# EAGLE design Galaksija keyboard matrix (EAGLE 9.6.2)
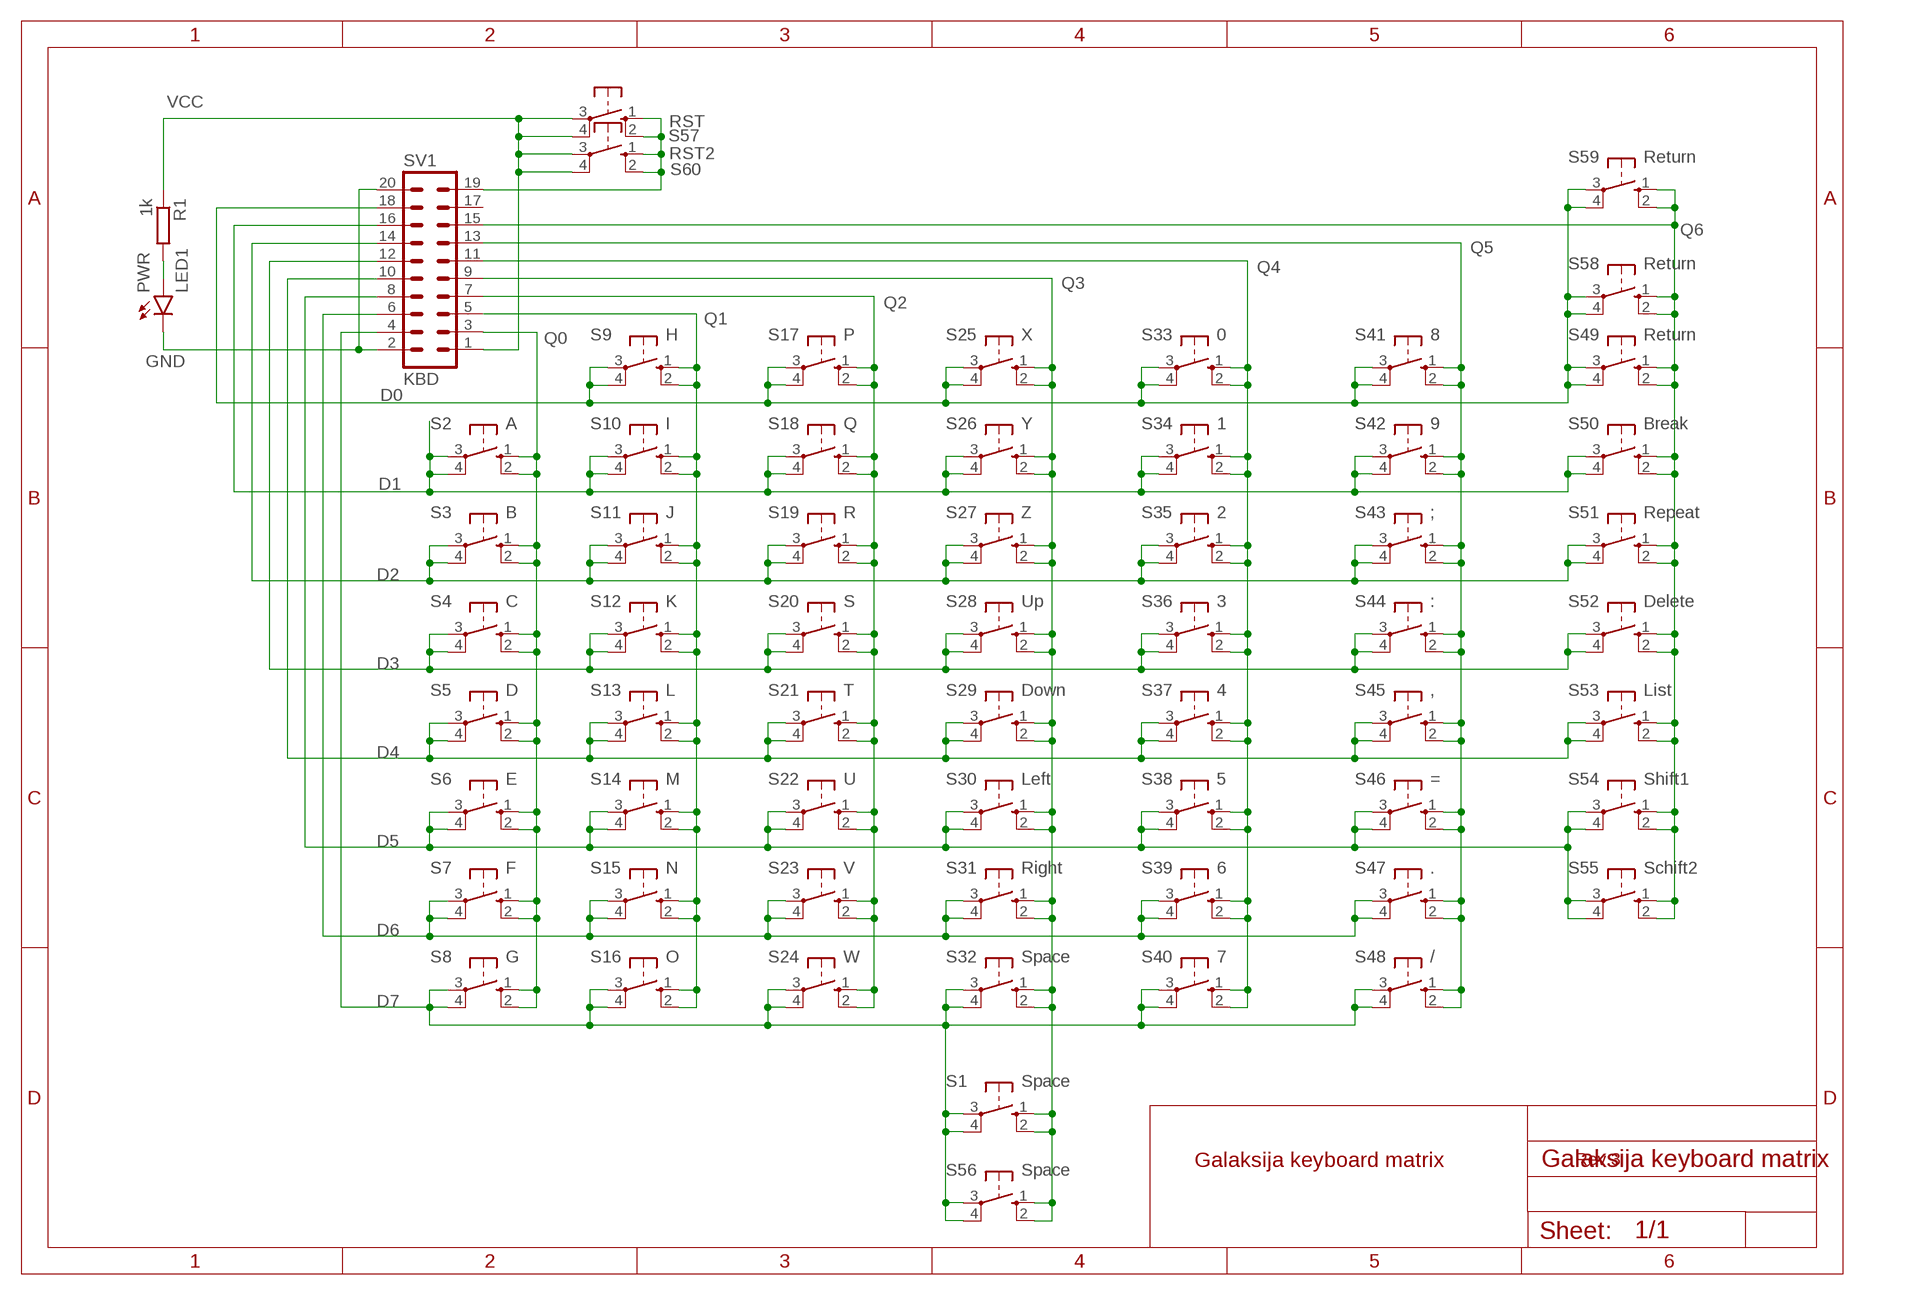
[diagram p0: schematic, sheet 1]

## Parts
LED1  PWR  LED5MM  [LED5MM]
R1  1k  R-EU_0207/10  [0207/10]
S1  Space  40-XX  [B3F-40XX]
S2  A  40-XX  [B3F-40XX]
S3  B  40-XX  [B3F-40XX]
S4  C  40-XX  [B3F-40XX]
S5  D  40-XX  [B3F-40XX]
S6  E  40-XX  [B3F-40XX]
S7  F  40-XX  [B3F-40XX]
S8  G  40-XX  [B3F-40XX]
S9  H  40-XX  [B3F-40XX]
S10  I  40-XX  [B3F-40XX]
S11  J  40-XX  [B3F-40XX]
S12  K  40-XX  [B3F-40XX]
S13  L  40-XX  [B3F-40XX]
S14  M  40-XX  [B3F-40XX]
S15  N  40-XX  [B3F-40XX]
S16  O  40-XX  [B3F-40XX]
S17  P  40-XX  [B3F-40XX]
S18  Q  40-XX  [B3F-40XX]
S19  R  40-XX  [B3F-40XX]
S20  S  40-XX  [B3F-40XX]
S21  T  40-XX  [B3F-40XX]
S22  U  40-XX  [B3F-40XX]
S23  V  40-XX  [B3F-40XX]
S24  W  40-XX  [B3F-40XX]
S25  X  40-XX  [B3F-40XX]
S26  Y  40-XX  [B3F-40XX]
S27  Z  40-XX  [B3F-40XX]
S28  Up  40-XX  [B3F-40XX]
S29  Down  40-XX  [B3F-40XX]
S30  Left  40-XX  [B3F-40XX]
S31  Right  40-XX  [B3F-40XX]
S32  Space  40-XX  [B3F-40XX]
S33  0  40-XX  [B3F-40XX]
S34  1  40-XX  [B3F-40XX]
S35  2  40-XX  [B3F-40XX]
S36  3  40-XX  [B3F-40XX]
S37  4  40-XX  [B3F-40XX]
S38  5  40-XX  [B3F-40XX]
S39  6  40-XX  [B3F-40XX]
S40  7  40-XX  [B3F-40XX]
S41  8  40-XX  [B3F-40XX]
S42  9  40-XX  [B3F-40XX]
S43  ;  40-XX  [B3F-40XX]
S44  :  40-XX  [B3F-40XX]
S45  ,  40-XX  [B3F-40XX]
S46  =  40-XX  [B3F-40XX]
S47  .  40-XX  [B3F-40XX]
S48  /  40-XX  [B3F-40XX]
S49  Return  40-XX  [B3F-40XX]
S50  Break  40-XX  [B3F-40XX]
S51  Repeat  40-XX  [B3F-40XX]
S52  Delete  40-XX  [B3F-40XX]
S53  List  40-XX  [B3F-40XX]
S54  Shift1  40-XX  [B3F-40XX]
S55  Schift2  40-XX  [B3F-40XX]
S56  Space  40-XX  [B3F-40XX]
S57  RST  40-XX  [B3F-40XX]
S58  Return  40-XX  [B3F-40XX]
S59  Return  40-XX  [B3F-40XX]
S60  RST2  10-XX  [B3F-10XX]
SV1  KBD  ML20  [ML20]

## Nets
D0: S9.3(P) S9.4(P1) S17.3(P) S17.4(P1) S25.3(P) S25.4(P1) S33.3(P) S33.4(P1) S41.3(P) S41.4(P1) S49.3(P) S49.4(P1) S58.3(P) S58.4(P1) S59.3(P) S59.4(P1) SV1.18
D1: S2.3(P) S2.4(P1) S10.3(P) S10.4(P1) S18.3(P) S18.4(P1) S26.3(P) S26.4(P1) S34.3(P) S34.4(P1) S42.3(P) S42.4(P1) S50.3(P) S50.4(P1) SV1.16
D2: S3.3(P) S3.4(P1) S11.3(P) S11.4(P1) S19.3(P) S19.4(P1) S27.3(P) S27.4(P1) S35.3(P) S35.4(P1) S43.3(P) S43.4(P1) S51.3(P) S51.4(P1) SV1.14
D3: S4.3(P) S4.4(P1) S12.3(P) S12.4(P1) S20.3(P) S20.4(P1) S28.3(P) S28.4(P1) S36.3(P) S36.4(P1) S44.3(P) S44.4(P1) S52.3(P) S52.4(P1) SV1.12
D4: S5.3(P) S5.4(P1) S13.3(P) S13.4(P1) S21.3(P) S21.4(P1) S29.3(P) S29.4(P1) S37.3(P) S37.4(P1) S45.3(P) S45.4(P1) S53.3(P) S53.4(P1) SV1.10
D5: S6.3(P) S6.4(P1) S14.3(P) S14.4(P1) S22.3(P) S22.4(P1) S30.3(P) S30.4(P1) S38.3(P) S38.4(P1) S46.3(P) S46.4(P1) S54.3(P) S54.4(P1) S55.3(P) S55.4(P1) SV1.8
D6: S7.3(P) S7.4(P1) S15.3(P) S15.4(P1) S23.3(P) S23.4(P1) S31.3(P) S31.4(P1) S39.3(P) S39.4(P1) S47.3(P) S47.4(P1) SV1.6
D7: S1.3(P) S1.4(P1) S8.3(P) S8.4(P1) S16.3(P) S16.4(P1) S24.3(P) S24.4(P1) S32.3(P) S32.4(P1) S40.3(P) S40.4(P1) S48.3(P) S48.4(P1) S56.3(P) S56.4(P1) SV1.4
GND: LED1.K(C) SV1.2 SV1.20
N$1: LED1.A R1.2
Q0: S2.1(S) S2.2(S1) S3.1(S) S3.2(S1) S4.1(S) S4.2(S1) S5.1(S) S5.2(S1) S6.1(S) S6.2(S1) S7.1(S) S7.2(S1) S8.1(S) S8.2(S1) SV1.3
Q1: S9.1(S) S9.2(S1) S10.1(S) S10.2(S1) S11.1(S) S11.2(S1) S12.1(S) S12.2(S1) S13.1(S) S13.2(S1) S14.1(S) S14.2(S1) S15.1(S) S15.2(S1) S16.1(S) S16.2(S1) SV1.5
Q2: S17.1(S) S17.2(S1) S18.1(S) S18.2(S1) S19.1(S) S19.2(S1) S20.1(S) S20.2(S1) S21.1(S) S21.2(S1) S22.1(S) S22.2(S1) S23.1(S) S23.2(S1) S24.1(S) S24.2(S1) SV1.7
Q3: S1.1(S) S1.2(S1) S25.1(S) S25.2(S1) S26.1(S) S26.2(S1) S27.1(S) S27.2(S1) S28.1(S) S28.2(S1) S29.1(S) S29.2(S1) S30.1(S) S30.2(S1) S31.1(S) S31.2(S1) S32.1(S) S32.2(S1) S56.1(S) S56.2(S1) SV1.9
Q4: S33.1(S) S33.2(S1) S34.1(S) S34.2(S1) S35.1(S) S35.2(S1) S36.1(S) S36.2(S1) S37.1(S) S37.2(S1) S38.1(S) S38.2(S1) S39.1(S) S39.2(S1) S40.1(S) S40.2(S1) SV1.11
Q5: S41.1(S) S41.2(S1) S42.1(S) S42.2(S1) S43.1(S) S43.2(S1) S44.1(S) S44.2(S1) S45.1(S) S45.2(S1) S46.1(S) S46.2(S1) S47.1(S) S47.2(S1) S48.1(S) S48.2(S1) SV1.13
Q6: S49.1(S) S49.2(S1) S50.1(S) S50.2(S1) S51.1(S) S51.2(S1) S52.1(S) S52.2(S1) S53.1(S) S53.2(S1) S54.1(S) S54.2(S1) S55.1(S) S55.2(S1) S58.1(S) S58.2(S1) S59.1(S) S59.2(S1) SV1.15
RST: S57.1(S) S57.2(S1) S60.1(S) S60.2(S1) SV1.19
VCC: R1.1 S57.3(P) S57.4(P1) S60.3(P) S60.4(P1) SV1.1
Unconnected: SV1.17

## Notes on the sheet
- Galaksija keyboard matrix | Rev.3

## Library data of the parts
LED1 = led:LED: LED OSRAM: - CHIPLED LG R971, LG N971, LY N971, LG Q971, LY Q971, LO R971, LY R971 LH N974, LH R974 LS Q976, LO Q976, LY Q976 LO Q996 - Hyper CHIPLED LW Q18S LB Q993, LB Q99A, LB R99A - SideLED LS A670, LO A670, LY A670, LG A670, LP A670 LB A673, LV A673, LT A673, LW A673 LH A674 LY A675 LS A676, LA A676, LO A676, LY A676, LW A676 LS A679, LY A679, LG A679 - Hyper Micro SIDELED® LS Y876, LA Y876, LO Y876, LY Y876 LT Y87S - SmartLED LW L88C, LW L88S LB L89C, LB L89S, LG L890 LS L89K, LO L89K, LY L89K LS L896, LA L896, LO L896, LY L896 - TOPLED LS T670, LO T670, LY T670, LG T670, LP T670 LSG T670, LSP T670, LSY T670, LOP T670, LYG T670 LG T671, LOG T671, LSG T671 LB T673, LV T673, LT T673, LW T673 LH T674 LS T676, LA T676, LO T676, LY T676, LB T676, LH T676, LSB T676, LW T676 LB T67C, LV T67C, LT T67C, LS T67K, LO T67K, LY T67K, LW E67C LS E67B, LA E67B, LO E67B, LY E67B, LB E67C, LV E67C, LT E67C LW T67C LS T679, LY T679, LG T679 LS T770, LO T770, LY T770, LG T770, LP T770 LB T773, LV T773, LT T773, LW T773 LH T774 LS E675, LA E675, LY E675, LS T675 LS T776, LA T776, LO T776, LY T776, LB T776 LHGB T686 LT T68C, LB T68C - Hyper Mini TOPLED® LB M676 - Mini TOPLED Santana® LG M470 LS M47K, LO M47K, LY M47K Source: http://www.osram.convergy.de LUXEON: - LUMILED® LXK2-PW12-R00, LXK2-PW12-S00, LXK2-PW14-U00, LXK2-PW14-V00 LXK2-PM12-R00, LXK2-PM12-S00, LXK2-PM14-U00 LXK2-PE12-Q00, LXK2-PE12-R00, LXK2-PE12-S00, LXK2-PE14-T00, LXK2-PE14-U00 LXK2-PB12-K00, LXK2-PB12-L00, LXK2-PB12-M00, LXK2-PB14-N00, LXK2-PB14-P00, LXK2-PB14-Q00 LXK2-PR12-L00, LXK2-PR12-M00, LXK2-PR14-Q00, LXK2-PR14-R00 LXK2-PD12-Q00, LXK2-PD12-R00, LXK2-PD12-S00 LXK2-PH12-R00, LXK2-PH12-S00 LXK2-PL12-P00, LXK2-PL12-Q00, LXK2-PL12-R00 Source: www.luxeon.com KINGBRIGHT: KA-3528ASYC Source: www.kingbright.com
R1 = rcl:R-EU_: RESISTOR, European symbol; SPICEPREFIX: R
S1-S59 = switch-omron:40-XX: OMRON SWITCH; MF: OMRON COMPONENTS USA; MPN: B3F-4000; OC_FARNELL: 176434; OC_NEWARK: 36K3105
S60 = switch-omron:10-XX: OMRON SWITCH; MPN: B3F-1000; OC_FARNELL: 176432; OC_NEWARK: 36M3542
SV1 = con-harting-ml:ML20: HARTING; OC_FARNELL: unknown; OC_NEWARK: unknown

## Board
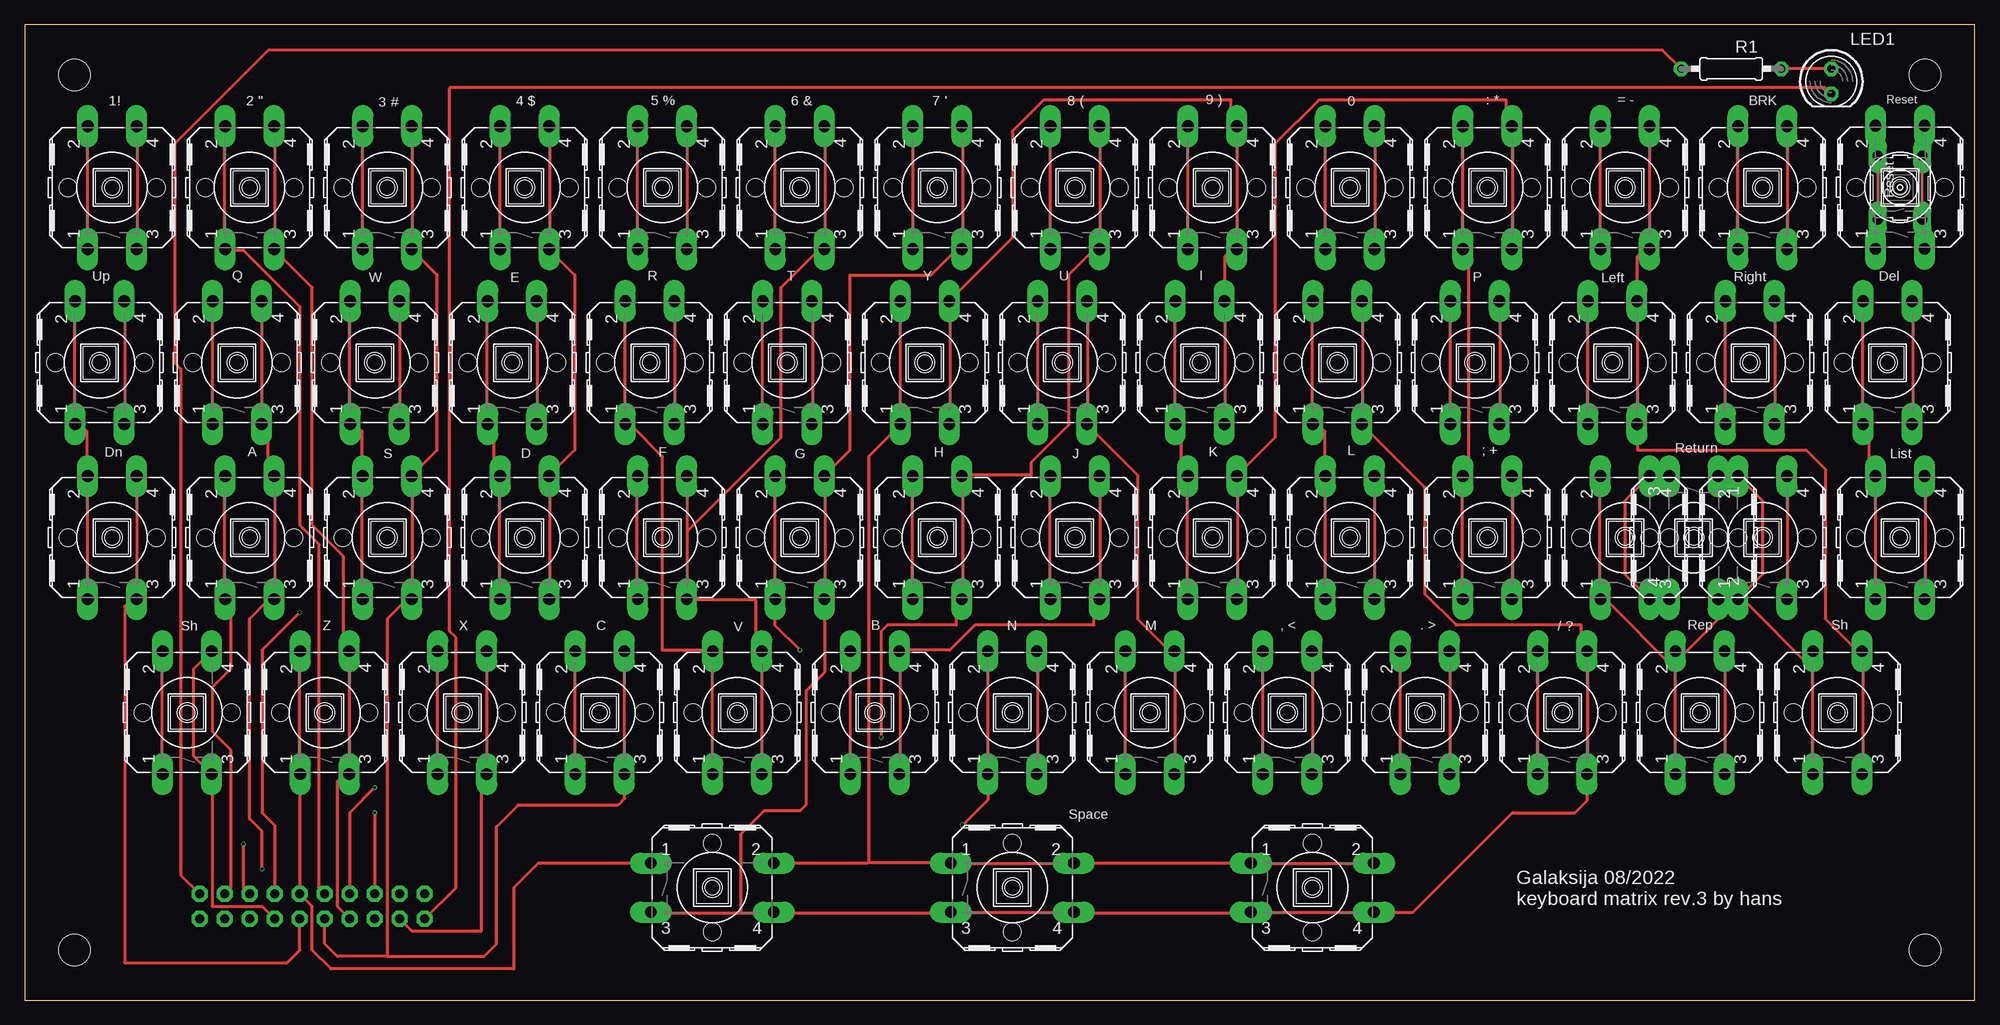
[diagram p1: board, top side]
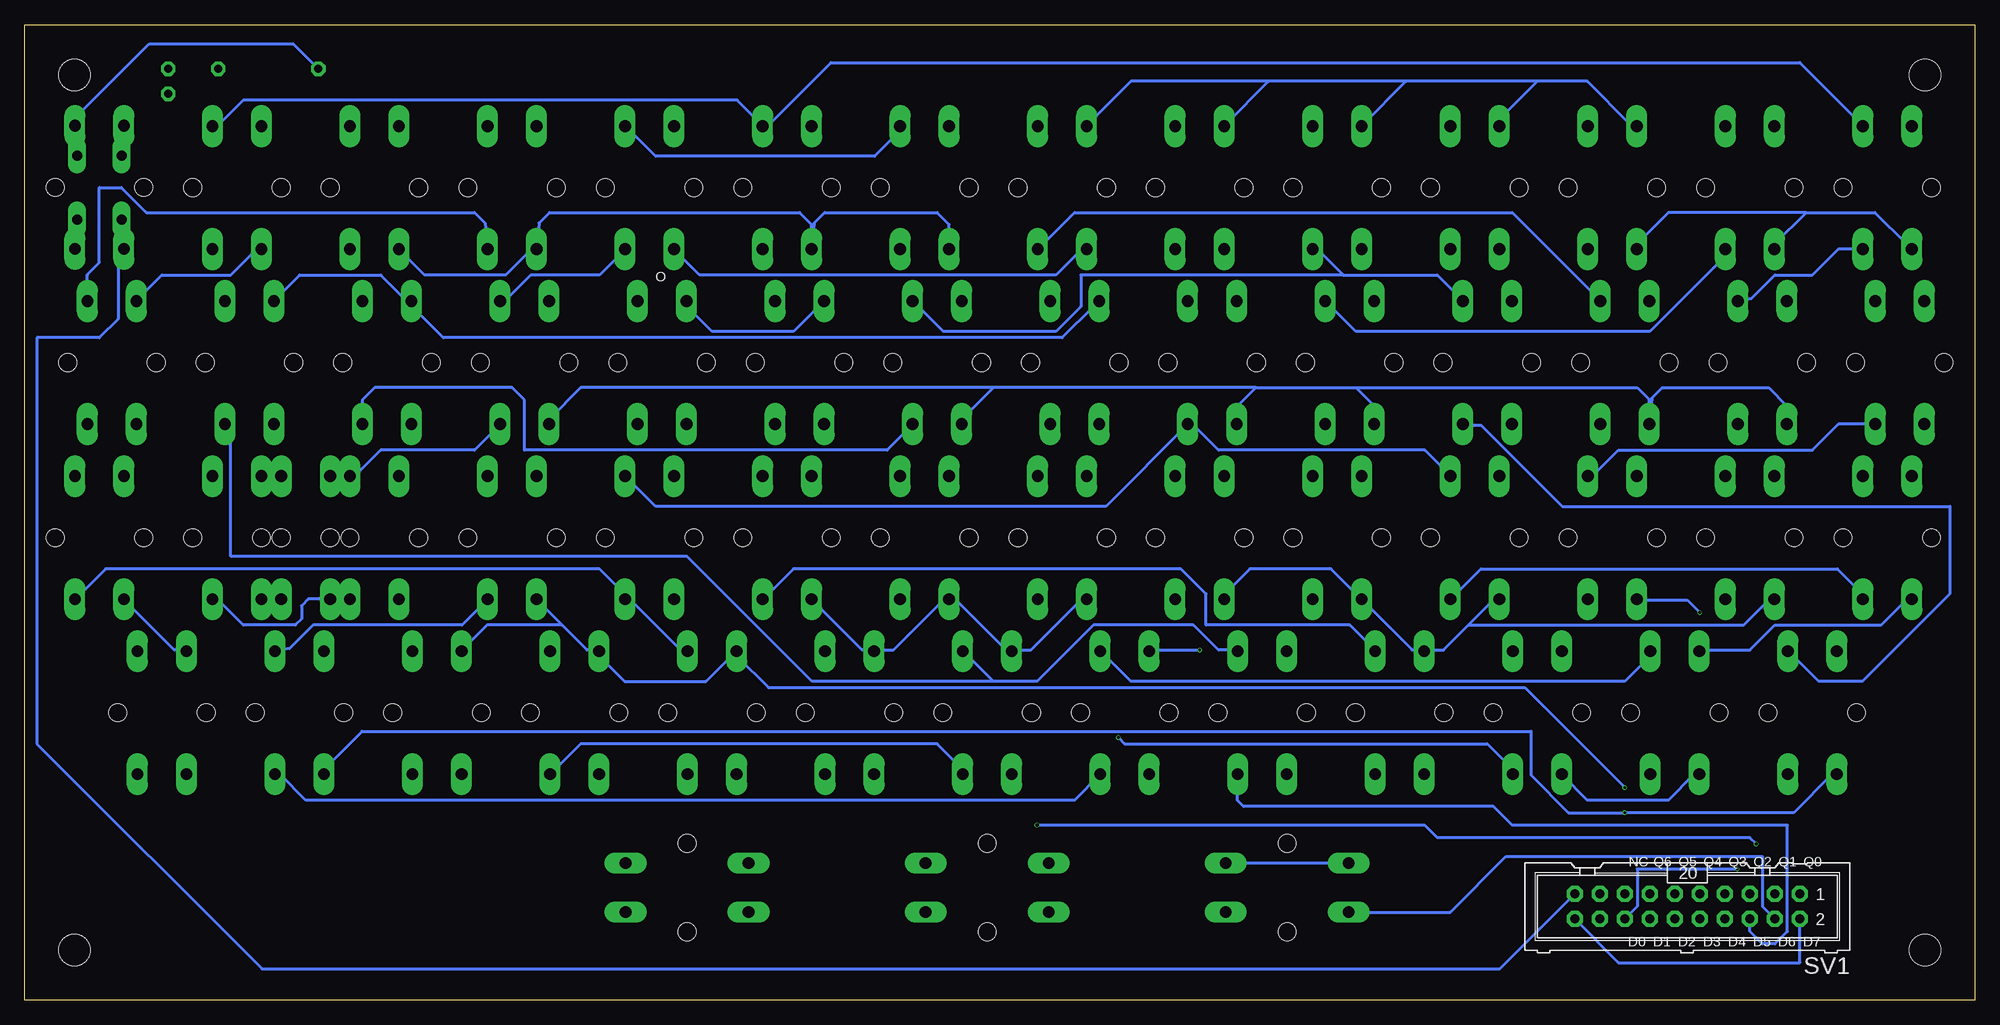
[diagram p2: board, bottom side, seen from below]

Size 198.1 x 99.11 mm. Coordinates in mm from the lower left corner, seen from the top.
Outline: 0,0 198.1,0 198.1,99.11 0,99.11 0,0
Copper layers (1*16): Top 0.035mm / dielectric 1.6mm / Bottom 0.035mm
Design rules "jlcpcb-2layers *": minimum track width 12mil, minimum drill 0.3mm, track to track 8mil, track to pad 8mil, pad to pad 8mil, via to via 8mil, smd to smd 5mil, copper to edge 0.2mm, drill to drill 8mil, minimum pad ring 10mil, minimum via ring 3mil, stop-mask expansion 4mil, vias tented up to drill 0mil, thermal gap 10mil
Holes 3.2 mm at 193.04,93.98 5.08,93.98 5.08,5.08 193.04,5.08

### Footprints (pad centres in the part's own frame; a part is rotated, then mirrored left to right if it is on the bottom)
LED5MM = drill 0.813 octagon: A -1.27,0; K 1.27,0
0207/10 = drill 0.813 octagon: 1 -5.08,0; 2 5.08,0
B3F-40XX = drill 1.194 long: 1 -6.248,2.489; 2 6.248,2.489; 3 -6.248,-2.489; 4 6.248,-2.489 | hole 1.803: 0,-4.496; 0,4.496
B3F-10XX = drill 1.016 long: 1 -3.251,2.261; 2 3.251,2.261; 3 -3.251,-2.261; 4 3.251,-2.261
ML20 = drill 0.914 octagon: 1 -11.43,-1.27; 2 -11.43,1.27; 3 -8.89,-1.27; 4 -8.89,1.27; 5 -6.35,-1.27; 6 -6.35,1.27; 7 -3.81,-1.27; 8 -3.81,1.27; 9 -1.27,-1.27; 10 -1.27,1.27; 11 1.27,-1.27; 12 1.27,1.27; 13 3.81,-1.27; 14 3.81,1.27; 15 6.35,-1.27; 16 6.35,1.27; 17 8.89,-1.27; 18 8.89,1.27; 19 11.43,-1.27; 20 11.43,1.27

### Placement (x,y rotation side)
LED1  183.51,93.34 270 top
R1  173.35,94.61 0 top
S1  69.85,11.43 0 top
S2  22.86,46.99 90 top
S3  86.36,29.21 90 top
S4  58.42,29.21 90 top
S5  50.8,46.99 90 top
S6  49.53,64.77 90 top
S7  64.77,46.99 90 top
S8  78.74,46.99 90 top
S9  92.71,46.99 90 top
S10  119.38,64.77 90 top
S11  106.68,46.99 90 top
S12  120.65,46.99 90 top
S13  134.62,46.99 90 top
S14  114.3,29.21 90 top
S15  100.33,29.21 90 top
S16  133.35,64.77 90 top
S17  147.32,64.77 90 top
S18  21.59,64.77 90 top
S19  63.5,64.77 90 top
S20  36.83,46.99 90 top
S21  77.47,64.77 90 top
S22  105.41,64.77 90 top
S23  72.39,29.21 90 top
S24  35.56,64.77 90 top
S25  44.45,29.21 90 top
S26  91.44,64.77 90 top
S27  30.48,29.21 90 top
S28  7.62,64.77 90 top
S29  8.89,46.99 90 top
S30  161.29,64.77 90 top
S31  175.26,64.77 90 top
S32  100.33,11.43 0 top
S33  134.62,82.55 90 top
S34  8.89,82.55 90 top
S35  22.86,82.55 90 top
S36  36.83,82.55 90 top
S37  50.8,82.55 90 top
S38  64.77,82.55 90 top
S39  78.74,82.55 90 top
S40  92.71,82.55 90 top
S41  106.68,82.55 90 top
S42  120.65,82.55 90 top
S43  148.59,46.99 90 top
S44  148.59,82.55 90 top
S45  128.27,29.21 90 top
S46  162.56,82.55 90 top
S47  142.24,29.21 90 top
S48  156.21,29.21 90 top
S49  162.56,46.99 90 top
S50  176.53,82.55 90 top
S51  170.18,29.21 90 top
S52  189.23,64.77 90 top
S53  190.5,46.99 90 top
S54  16.51,29.21 90 top
S55  184.15,29.21 90 top
S56  130.81,11.43 0 top
S57  190.5,82.58 90 top
S58  176.53,46.99 90 top
S59  169.54,46.99 270 top
S60  190.5,82.55 90 top
SV1  29.21,9.53 180 bottom

### Tracks (layer width: path | path; a pad name or v marks a point on that pad's centre or on a via)
D0  (via drill 0.3)
  Top 0.305: S58.3 179.07,41.27 179.07,52.7 S58.4 | S49.3 162.56,43.23 162.56,50.75 S49.4 | S17.3 149.86,59.05 149.86,70.48 S17.4 | S33.3 137.16,76.83 137.16,88.27 S33.4 | SV1.18 39.37,6.99 46.35,6.99 46.35,22.86 S25.3 46.99,23.5 46.99,34.92 S25.4 | S41.4 109.22,88.27 109.22,76.83 S41.3 108.59,76.2 106.05,73.66 106.05,58.42 102.23,54.61 102.23,53.34 95.25,53.34 S9.4 95.25,52.7 95.25,41.27 S9.3 94.62,40.64 94.62,38.1 87.63,38.1 87,37.47 v87,26.67
  Bottom 0.305: S17.4 149.22,71.12 146.69,73.66 139.7,73.66 137.16,76.2 S33.3 | S17.3 149.86,58.42 152.4,55.88 161.92,55.88 164.47,53.34 S49.4 S59.3 | S58.3 178.44,40.64 175.89,38.1 170.59,38.1 169.96,38.73 169.96,40.07 169.28,40.74 S59.4 S49.3 | v87,26.67 86.36,26.04 49.53,26.04 46.99,23.5 S25.3 | S33.4 136.52,88.27 133.98,85.72 111.76,85.72 109.22,88.27 S41.4
D1  (via drill 0.3)
  Top 0.305: S34.3 11.43,76.83 11.43,88.27 S34.4 | S18.4 24.13,70.48 24.13,59.05 S18.3 24.13,58.42 24.77,57.78 24.77,53.34 S2.4 25.4,52.7 25.4,41.27 S2.3 24.77,40.64 22.86,38.73 22.86,18.41 24.13,17.14 v24.13,13.34 | S50.3 179.07,76.83 179.07,88.27 S50.4 | S26.3 93.98,59.05 93.98,70.48 S26.4 93.98,71.12 100.33,77.47 100.33,88.27 103.51,91.44 122.56,91.44 122.56,88.9 S42.4 123.19,88.27 123.19,76.83 S42.3 122.56,76.2 121.92,75.56 121.92,71.12 S10.4 121.92,70.48 121.92,59.05 S10.3
  Bottom 0.305: SV1.16 34.29,9.53 34.29,13.34 v24.13,13.34 | S34.3 13.87,76.3 16.51,73.66 20.32,73.66 22.73,71.25 S18.4 | S50.4 178.44,88.9 175.89,91.44 125.73,91.44 123.19,88.9 S42.4 122.56,88.9 116.2,95.25 17.78,95.25 11.43,88.9 S34.4
D2
  Top 0.305: S51.3 172.72,23.5 172.72,34.92 S51.4 | S43.3 151.13,41.27 151.13,52.7 S43.4 | S3.3 88.9,23.5 88.9,34.92 S3.4 88.9,35.56 93.98,35.56 96.52,38.1 108.59,38.1 108.59,40.64 S11.3 109.22,41.27 109.22,52.7 S11.4 | S19.3 66.04,59.05 66.04,70.48 S19.4 | S35.4 25.4,88.27 25.4,76.83 S35.3 25.4,76.2 29.21,72.39 29.21,48.26 32.38,45.09 32.38,35.56 S27.4 33.02,34.92 33.02,23.5 S27.3 32.38,22.86 31.75,22.23 31.75,9.53 SV1.14
  Bottom 0.305: S51.4 171.2,35.71 168.81,38.1 153.67,38.1 151.13,40.64 S43.3 | S19.4 65.41,70.48 62.87,67.94 33.02,67.94 24.77,76.2 S35.3 | S3.4 88.27,34.92 85.73,32.38 35.56,32.38 33.02,34.92 S27.4 | S51.3 172.08,22.86 169.54,20.32 91.44,20.32 88.9,22.86 S3.3
D3
  Top 0.305: S52.3 191.77,59.05 191.77,70.48 S52.4 | S12.3 123.19,41.27 123.19,52.7 S12.4 123.19,53.34 127,57.15 127,87 131.44,91.44 150.49,91.44 150.49,88.9 S44.4 151.13,88.27 151.13,76.83 S44.3 | SV1.12 30.48,5.71 31.75,4.45 36.83,4.45 | S36.4 39.37,88.27 39.37,76.83 S36.3 39.37,76.2 41.91,73.66 41.91,55.88 39.37,53.34 S20.4 39.37,52.7 39.37,41.27 S20.3 38.73,40.64 36.83,38.73 36.83,4.45 | S28.3 10.16,59.05 10.16,70.48 S28.4 | 36.83,4.45 46.67,4.45 47.94,5.71 47.94,17.62 50.16,19.84 60.32,19.84 60.96,20.48 60.91,20.53 S4.3 S4.4
  Bottom 0.305: S44.3 151.33,78.94 152.4,80.01 185.74,80.01 188.28,82.55 190.5,82.55 190.5,74.93 191.77,73.66 191.72,73.61 S52.4 | S28.3 13.87,58.52 16.51,55.88 36.2,55.88 38.73,53.34 S20.4 | S12.3 122.56,41.27 120.02,43.81 80.65,43.81 78.11,41.27 78.11,38.1 63.5,38.1 60.96,35.56 S4.4
D4
  Top 0.305: S53.3 193.04,41.27 193.04,52.7 S53.4 | S45.3 130.81,23.5 130.81,34.92 S45.4 | S13.4 137.16,52.7 137.16,41.27 S13.3 | SV1.10 27.94,5.08 26.67,3.81 10.16,3.81 10.16,40.01 10.79,40.64 S29.3 11.43,41.27 11.43,52.7 S29.4 | S21.3 80.01,59.05 80.01,70.48 S21.4 | S5.3 53.34,41.27 53.34,52.7 S5.4 53.34,53.34 55.88,55.88 55.88,73.66 53.34,76.2 S37.3 53.34,76.83 53.34,88.27 S37.4
  Bottom 0.305: S45.4 130.81,35.56 131.44,35.56 136.52,40.64 S13.3 137.16,41.27 139.7,43.81 189.86,43.81 192.41,41.27 S53.3 | S5.4 53.34,53.34 55.88,55.88 76.84,55.88 79.38,58.42 S21.3 80.01,58.42 88.27,50.16 133.98,50.16 136.52,52.7 S13.4 | S29.3 11.43,41.27 13.97,43.81 50.16,43.81 52.7,41.27 S5.3
D5
  Top 0.305: S55.3 186.69,23.5 186.69,34.92 S55.4 186.05,35.56 182.88,38.73 182.88,53.98 180.97,55.88 163.83,55.88 163.83,58.42 S30.3 163.83,59.05 163.83,70.48 S30.4 163.83,71.12 163.83,75.56 164.47,76.2 S46.3 165.1,76.83 165.1,88.27 S46.4 | S14.3 116.84,23.5 116.84,34.92 S14.4 116.2,35.56 113.03,38.73 113.03,53.34 107.95,58.42 S22.3 107.95,59.05 107.95,70.48 S22.4 | SV1.8 24.13,9.53 19.05,9.53 19.05,22.86 S54.3 17.14,24.82 17.14,33.6 S54.4 | S6.3 52.07,59.05 52.07,70.48 S6.4 | S38.3 67.31,76.83 67.31,88.27 S38.4
  Bottom 0.305: 64.14,73.66 54.61,73.66 52.07,71.12 S6.4 | 64.14,73.66 66.67,76.2 S38.3 | S54.4 18.41,34.92 15.88,32.38 11.43,32.38 2.54,41.27 2.54,50.16 41.91,50.16 50.16,58.42 51.43,58.42 S6.3 | 64.14,73.66 90.81,73.66 90.81,70.48 93.34,67.94 104.78,67.94 107.31,70.48 S22.4 | S30.3 163.78,61.01 162.56,62.23 148.59,62.23 147.32,60.96 147.32,55.88 110.49,55.88 107.95,58.42 S22.3
D6
  Top 0.305: S31.3 177.8,59.05 177.8,70.48 S31.4 | S47.3 144.78,23.5 144.78,34.92 S47.4 | S39.4 81.28,88.27 81.28,76.83 S39.3 80.65,76.2 76.84,72.39 76.84,57.15 67.31,47.62 | S15.3 102.87,23.5 102.87,34.92 S15.4 | 67.31,47.62 67.31,52.7 S7.4 | 67.31,47.62 67.31,41.27 S7.3 67.31,40.64 74.3,40.64 74.3,35.56 S23.4 74.93,34.92 74.93,23.5 S23.3
  Bottom 0.305: SV1.6 22.86,6.99 21.59,5.71 20.32,5.71 19.05,6.99 19.05,17.78 46.99,17.78 48.89,19.68 74.3,19.68 74.93,20.32 74.93,22.91 S23.3 | 99.7,32.38 102.23,34.92 S15.4 | 99.7,32.38 95.25,32.38 89.54,38.1 79.38,38.1 76.84,35.56 74.93,35.56 S23.4 | S47.3 144.14,23.5 141.6,26.04 105.41,26.04 102.87,23.5 S15.3 | 99.7,32.38 118.11,32.38 130.81,45.09 177.16,45.09 177.16,58.42 S31.3
D7
  Top 0.305: S24.3 38.1,59.05 38.1,70.48 S24.4 | S40.4 95.25,88.27 95.25,76.83 S40.3 94.62,76.2 92.08,73.66 83.82,73.66 83.82,55.88 81.28,53.34 S8.4 81.28,52.7 81.28,41.27 S8.3 81.23,33.29 79.38,31.43 79.38,19.84 78.74,19.21 75.09,19.21 72.71,16.83 72.71,8.89 | S16.4 135.89,70.48 135.89,59.05 S16.3 135.89,58.42 142.24,52.07 142.24,41.27 145.41,38.1 158.11,38.1 158.11,35.56 S48.4 158.75,34.92 158.75,23.5 S48.3 158.75,22.91 158.75,20.32 157.48,19.05 151.13,19.05 141.02,8.94 S56.4 S56.3 124.46,8.89 106.68,8.89 | 72.71,8.89 64.14,8.89 S1.3 | 72.71,8.89 76.1,8.89 S1.4 76.2,8.89 93.98,8.89 S32.3 106.63,8.94 106.68,8.89 | 106.68,8.89 S32.4
  Bottom 0.305: S24.4 38.1,71.12 46.99,80.01 91.44,80.01 94.62,76.83 S40.3 | SV1.4 21.59,9.53 21.59,14.61 47.62,14.61 53.29,8.94 S1.3
GND
  Top 0.305: LED1.K 182.88,92.71 43.18,92.71 43.18,37.47 43.81,36.83 43.81,11.43 SV1.20
  Bottom 0.305: SV1.2 17.78,3.81 36.2,3.81 SV1.20
N$1
  Top 0.305: LED1.A R1.2
Q0  (via drill 0.3)
  Top 0.305: SV1.3 20.96,11.43 20.96,25.4 19.05,27.3 19.05,31.75 20.96,33.66 20.96,40.64 S2.1 20.32,41.27 20.32,52.7 S2.2 | S6.2 46.99,70.48 46.99,59.05 S6.1 47.62,58.42 47.62,53.98 48.26,53.34 S5.2 48.26,52.7 48.26,41.27 S5.1 | S3.1 83.82,23.5 83.82,34.92 S3.2 | S8.2 76.2,52.7 76.2,41.27 S8.1 76.2,40.69 76.2,38.1 v78.74,35.56 | S4.1 55.88,23.5 55.88,34.92 S4.2 | S7.2 62.23,52.7 62.23,41.27 S7.1
  Bottom 0.305: 51.43,38.1 53.97,35.56 55.88,35.56 S4.2 56.51,35.56 57.15,35.56 62.23,40.64 S7.1 62.87,41.27 65.41,43.81 73.66,43.81 76.2,41.27 S8.1 | 51.43,38.1 48.89,40.64 S5.1 | v78.74,35.56 83.82,35.56 S3.2 | 51.43,38.1 23.5,38.1 20.96,40.64 S2.1
Q1  (via drill 0.3, 0.35)
  Top 0.305: v22.23,15.88 22.23,11.43 SV1.5 | S9.2 90.17,52.7 90.17,41.27 S9.1 | S11.2 104.14,52.7 104.14,41.27 S11.1 | S13.1 132.08,41.27 132.08,52.7 S13.2 132.08,53.34 132.08,57.78 131.44,58.42 S16.1 130.81,59.05 130.81,70.48 S16.2 | S10.2 116.84,70.48 116.84,59.05 S10.1 117.48,58.42 117.48,53.98 118.11,53.34 S12.2 118.11,52.7 118.11,41.27 S12.1 | S14.1 111.76,23.5 111.76,34.92 S14.2 | S15.2 97.79,34.92 97.79,23.5 S15.1 97.84,20.37 v95.25,17.78
  Bottom 0.305: S9.1 90.81,40.64 95.89,35.56 97.79,35.56 S15.2 98.42,35.56 103.51,40.64 104.14,40.64 S11.1 104.78,40.64 109.86,35.56 111.76,35.56 S14.2 112.4,35.56 113.03,35.56 118.11,40.64 S12.1 | S16.2 130.81,70.48 128.27,67.94 120.02,67.94 117.48,70.48 S10.2 | v22.23,15.88 22.86,16.51 54.61,16.51 55.88,17.78 v95.25,17.78
Q2  (via drill 0.3)
  Top 0.305: S18.1 19.05,59.05 19.05,70.48 S18.2 | S24.2 33.02,70.48 33.02,59.05 S24.1 33.65,58.42 34.29,57.78 34.29,53.34 S20.2 34.29,52.7 34.29,41.27 S20.1 | SV1.7 25.4,17.78 24.13,19.05 24.13,35.56 v27.94,39.37 | S17.1 144.78,59.05 144.78,70.48 S17.2 | S22.1 102.87,59.05 102.87,70.48 S22.2 | S23.1 69.85,23.5 69.85,34.92 S23.2 69.85,35.56 64.77,35.56 64.77,55.24 61.59,58.42 S19.1 60.96,59.05 60.96,70.48 S19.2 | S21.1 74.93,59.05 74.93,70.48 S21.2
  Bottom 0.305: S18.1 19.1,60.38 20.96,62.23 31.75,62.23 32.82,61.16 S24.1 33.07,61.01 34.29,62.23 62.87,62.23 | v27.94,39.37 29.21,40.64 34.29,40.64 S20.1 | 62.87,62.23 61.01,60.38 S19.1 | 73.03,62.23 62.87,62.23 | 73.03,62.23 74.8,60.46 S21.1 | 99.7,62.23 102.87,59.05 S22.1 | 73.03,62.23 99.7,62.23 | 99.7,62.23 141.6,62.23 144.78,59.05 S17.1
Q3
  Top 0.305: S29.1 6.35,41.27 6.35,52.7 S29.2 6.35,53.34 6.35,57.78 5.71,58.42 S28.1 5.08,59.05 5.08,70.48 S28.2 | S25.1 41.91,23.5 41.91,34.92 S25.2 | S27.2 27.94,34.92 27.94,23.5 S27.1 27.94,22.86 SV1.9 29.21,9.53 29.21,5.08 31.11,3.17 49.69,3.17 49.69,11.43 52.18,13.92 S1.1 | S30.1 158.75,59.05 158.75,70.48 S30.2 | S31.1 172.72,59.05 172.72,70.48 S31.2 | S26.2 88.9,70.48 88.9,59.05 S26.1 88.9,58.42 85.73,55.24 85.73,13.97 | 85.73,13.97 93.98,13.97 S32.1 S32.2 106.68,13.97 124.46,13.97 S56.1 S56.2 | S1.2 76.15,13.97 85.73,13.97
  Bottom 0.305: S25.1 41.91,22.86 39.37,20.32 31.11,20.32 28.57,22.86 S27.1 | S29.1 6.99,40.64 9.53,38.1 20.32,38.1 22.86,35.56 27.94,35.56 S27.2 | S31.2 172.72,71.12 170.18,73.66 161.92,73.66 159.38,71.12 S30.2 158.75,70.48 155.57,67.31 92.71,67.31 89.54,70.48 S26.2 | S1.1 S1.2
Q4
  Top 0.305: S33.1 132.08,76.83 132.08,88.27 S33.2 | S40.1 90.17,76.83 90.17,88.27 S40.2 | S39.1 76.2,76.83 76.2,88.27 S39.2 | S38.1 62.23,76.83 62.23,88.27 S38.2 | S37.1 48.26,76.83 48.26,88.27 S37.2 | S36.1 34.29,76.83 34.29,88.27 S36.2 | S34.1 6.35,76.83 6.35,88.27 S34.2 | SV1.11 29.84,11.43 29.84,46.35 27.94,48.26 27.94,70.48 22.23,76.2 20.96,76.2 S35.1 20.32,76.83 20.32,88.27 S35.2
  Bottom 0.305: 17.14,80.01 10.16,80.01 6.99,76.83 S34.1 | 17.14,80.01 20.32,76.83 S35.1 | 17.14,80.01 31.11,80.01 34.29,76.83 S36.1 | 44.45,93.34 47.62,90.17 S37.2 | 44.45,93.34 39.37,93.34 34.92,88.9 S36.2 | 57.78,93.34 62.23,88.9 S38.2 | 44.45,93.34 57.78,93.34 | 71.76,93.34 76.2,88.9 S39.2 | 57.78,93.34 71.76,93.34 | 71.76,93.34 85.73,93.34 90.17,88.9 S40.2 | S33.1 132.08,76.2 129.54,73.66 93.34,73.66 90.81,76.2 S40.1
Q5  (via drill 0.3)
  Top 0.305: v35.56,21.59 33.02,19.05 SV1.13 | S45.1 125.73,23.5 125.73,34.92 S45.2 | S41.1 104.14,76.83 104.14,88.27 S41.2 | S42.1 118.11,76.83 118.11,88.27 S42.2 | S46.1 160.02,76.83 160.02,88.27 S46.2 | S44.2 146.05,88.27 146.05,76.83 S44.1 146.69,76.2 146.69,53.34 S43.2 146.05,52.7 146.05,41.27 S43.1 | S48.1 153.67,23.5 153.67,34.92 S48.2 | S47.1 139.7,23.5 139.7,34.92 S47.2
  Bottom 0.305: v35.56,21.59 45.72,31.75 122.56,31.75 125.73,34.92 S45.2 126.37,34.92 128.91,32.38 137.16,32.38 139.7,34.92 S47.2 140.33,35.56 140.97,35.56 143.51,38.1 | S41.1 104.19,78.79 105.41,80.01 116.84,80.01 117.91,78.94 S42.1 118.16,78.79 119.38,80.01 144.78,80.01 145.85,78.94 S44.1 146.69,76.2 149.22,73.66 157.48,73.66 160.02,76.2 S46.1 | 143.51,38.1 146.05,40.64 S43.1 | 143.51,38.1 151.13,38.1 153.67,35.56 S48.2
Q6  (via drill 0.3)
  Top 0.305: v35.56,19.05 SV1.15 | S54.2 13.97,34.92 13.97,23.5 S54.1 | 167.64,33.66 167.64,34.92 S51.2 | 167.64,33.66 167.64,23.5 S51.1 | 167.64,33.66 160.66,40.64 S49.1 160.02,41.27 160.02,52.7 S49.2 | 167.64,33.66 S51.2 | S58.1 173.99,40.64 168.27,34.92 S51.2 | S58.2 176.53,50.75 176.53,43.23 S58.1 | 181.61,33.66 181.61,34.92 S55.2 181.61,33.66 | 181.61,33.66 181.61,23.5 S55.1 | S50.1 173.99,76.83 173.99,88.27 S50.2 | S52.2 186.69,70.48 186.69,59.05 S52.1 187.32,58.42 187.32,53.98 187.96,53.34 S53.2 187.96,52.7 187.96,41.27 S53.1 | 181.61,33.66 174.62,40.64 S58.1
  Bottom 0.305: S54.1 14.61,22.86 18.41,19.05 v35.56,19.05 41.27,19.05 45.08,22.86 45.08,27.3 163.83,27.3 167.64,23.5 S51.1 | S53.1 187.96,40.64 182.88,35.56 182.24,35.56 S55.2 | S50.1 174.62,76.2 177.16,73.66 184.15,73.66 186.69,71.12 S52.2 | S59.1 S58.2 | S59.2 S58.1
RST
  Top 0.305: S60.2 S60.1
  Bottom 0.305: SV1.19 48.26,3.17 173.99,3.17 196.85,26.04 196.85,67.31 190.5,67.31 188.59,69.22 188.59,75.75 S57.1 188.01,79.07 S60.1 | S60.2 188.24,88.6 S57.2
VCC
  Top 0.305: SV1.1 15.88,12.7 15.88,64.14 15.24,64.77 15.24,87 24.77,96.52 166.37,96.52 R1.1 | S60.3 S60.4
  Bottom 0.305: R1.1 170.81,97.16 185.42,97.16 192.99,89.59 S57.4 192.76,88.6 S60.4 | S57.3 192.99,79.07 S60.3

### Text on the board
tPlace: 1! | 2 " | 3 # | 4 $ | 5 % | 6 & | 7 ' | 8 ( | 9 ) | 0 | : * | = - | BRK | Reset | Reset | Up | Q | W | E | R | T | Y | U | I | P | Left | Right | Del | Return | Dn | A | S | D | F | G | H | J | K | L | ; + | List | Sh | Z | X | C | B | N | M | , < | . > | / ? | Rep | Sh | V | Space | Galaksija 08/2022 / keyboard matrix rev.3 by hans
bPlace: O | Q0 | Q1 | Q2 | Q3 | Q4 | Q5 | Q6 | NC | D7 | D6 | D5 | D4 | D3 | D2 | D1 | D0